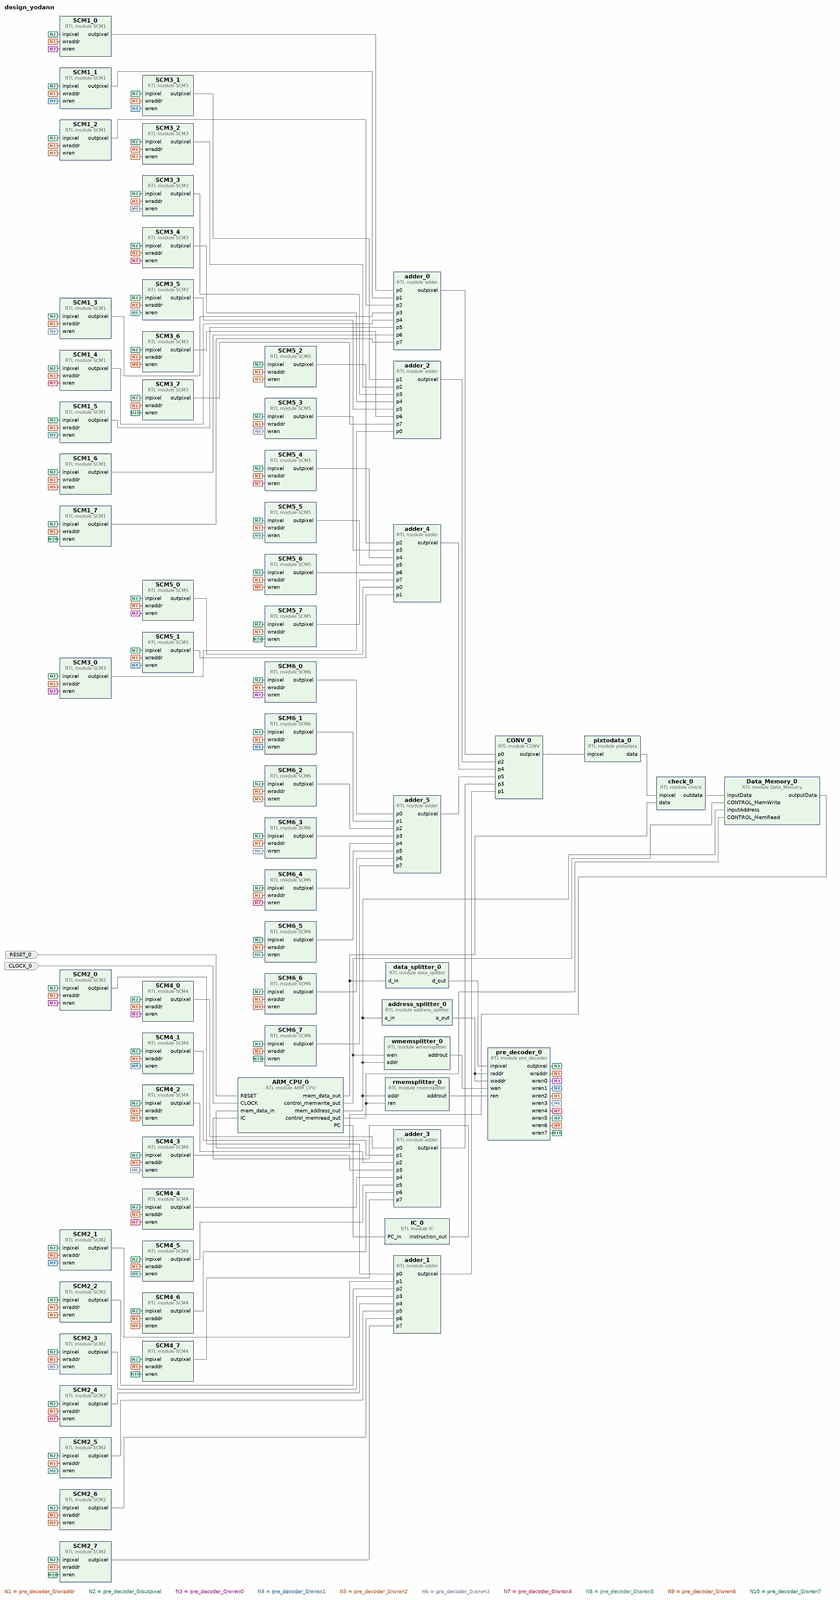
[diagram p0: block diagram of the top level, whole]
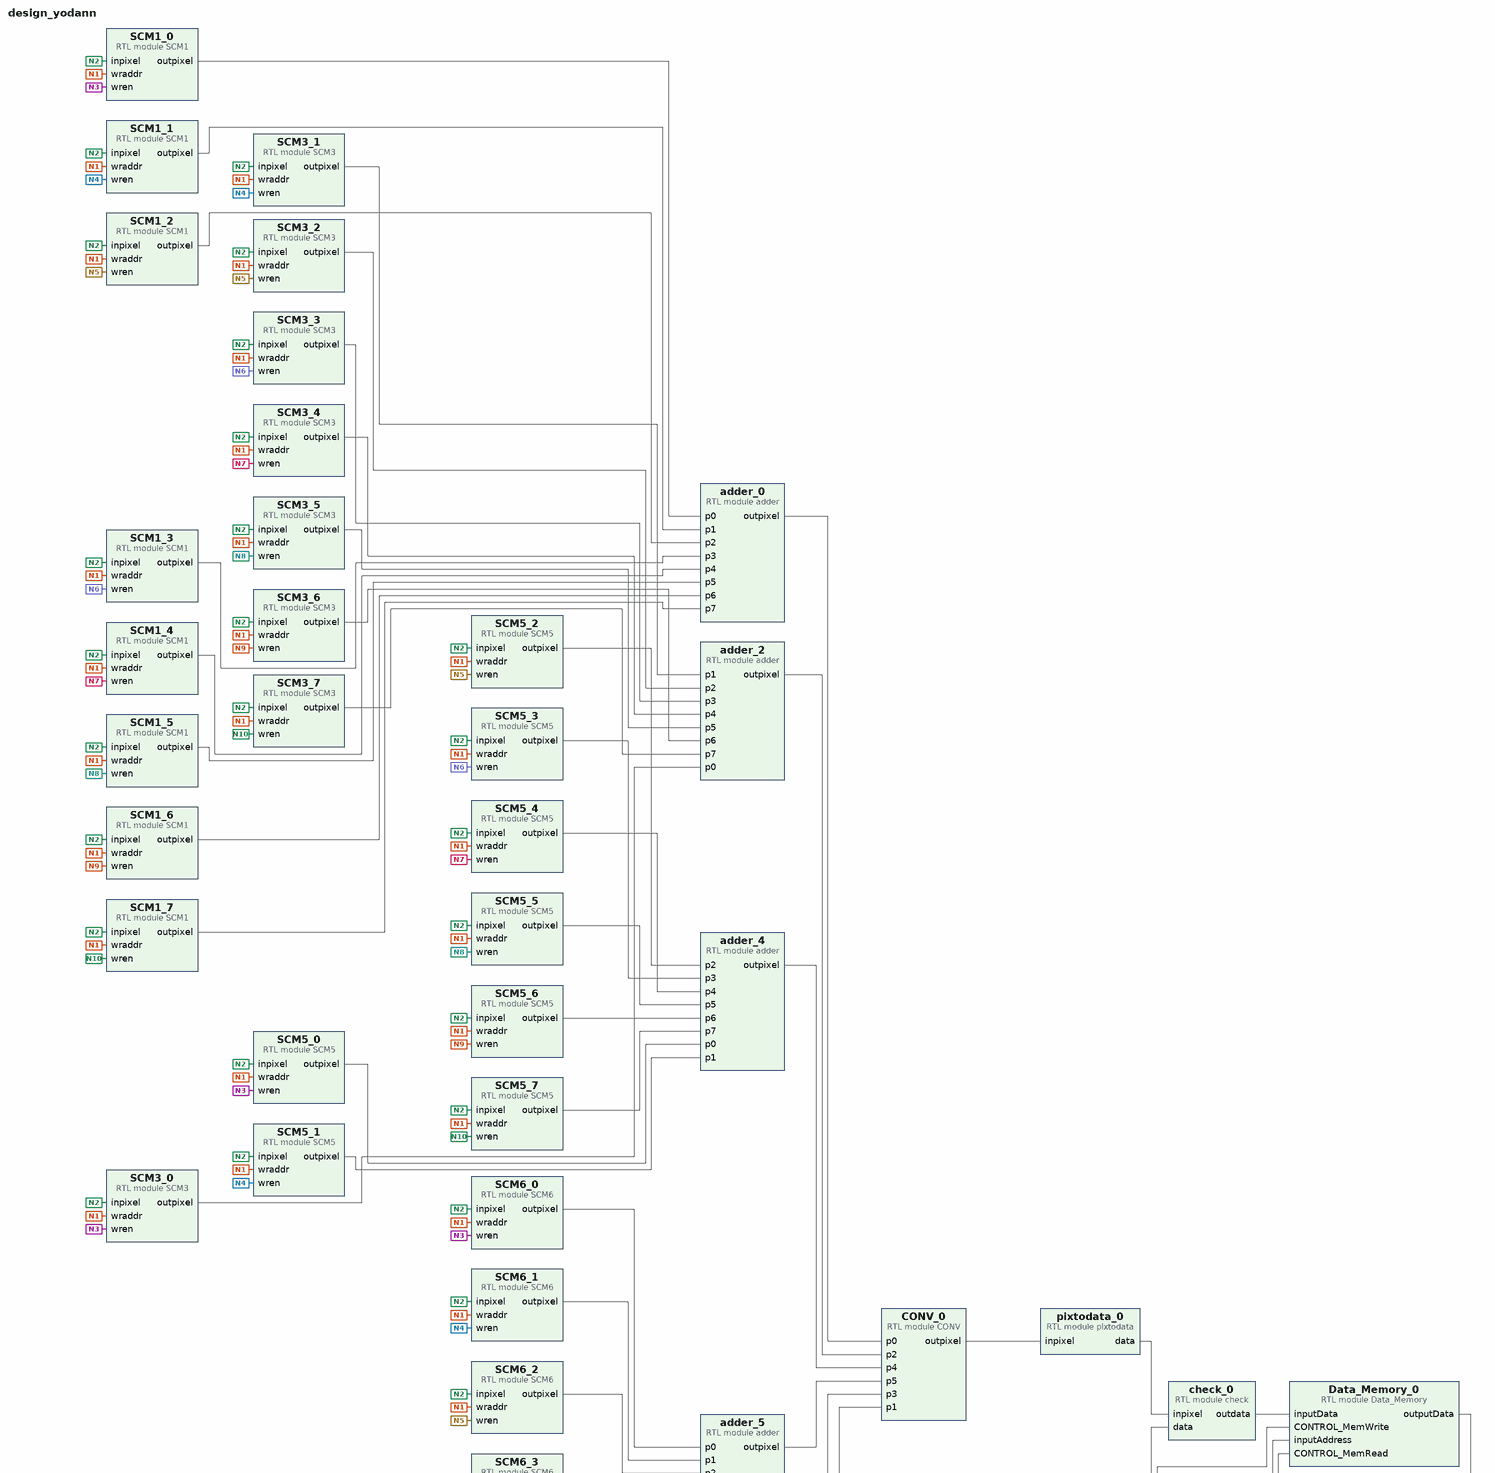
[diagram p1: block diagram of the top level, upper part]
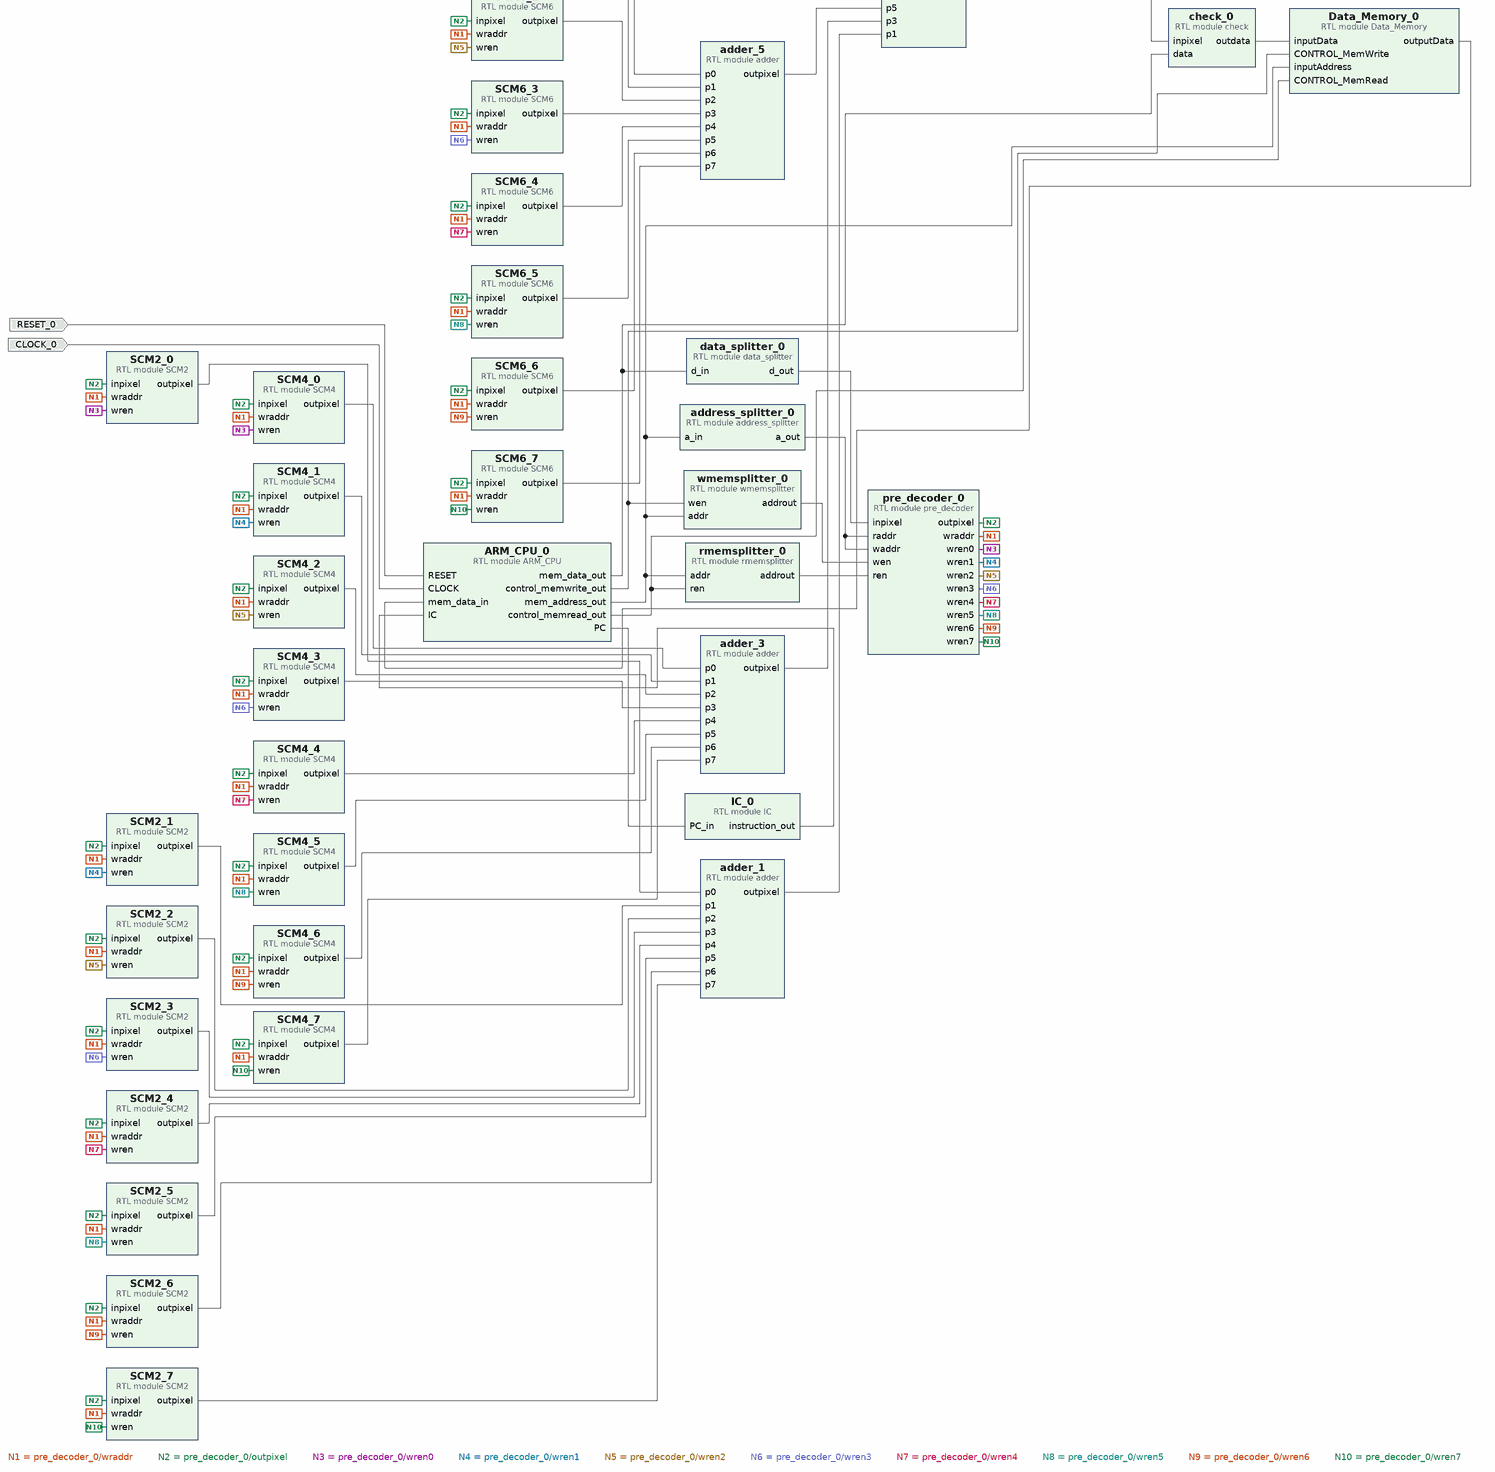
[diagram p2: block diagram of the top level, lower part]
# Vivado block design design_yodann, xc7a100tcsg324-1, Vivado 2018.3
create_bd_design design_yodann

create_bd_port -dir I -type rst RESET_0
create_bd_port -dir I -type clk CLOCK_0

create_bd_cell -type module -reference ARM_CPU ARM_CPU_0
create_bd_cell -type module -reference IC IC_0
create_bd_cell -type module -reference address_splitter address_splitter_0
create_bd_cell -type module -reference data_splitter data_splitter_0
create_bd_cell -type module -reference rmemsplitter rmemsplitter_0
create_bd_cell -type module -reference wmemsplitter wmemsplitter_0
create_bd_cell -type module -reference pre_decoder pre_decoder_0
create_bd_cell -type module -reference pixtodata pixtodata_0
create_bd_cell -type module -reference SCM1 SCM1_0
create_bd_cell -type module -reference SCM1 SCM1_1
create_bd_cell -type module -reference SCM1 SCM1_2
create_bd_cell -type module -reference SCM1 SCM1_3
create_bd_cell -type module -reference SCM1 SCM1_4
create_bd_cell -type module -reference SCM1 SCM1_5
create_bd_cell -type module -reference SCM1 SCM1_6
create_bd_cell -type module -reference SCM1 SCM1_7
create_bd_cell -type module -reference SCM2 SCM2_0
create_bd_cell -type module -reference SCM2 SCM2_1
create_bd_cell -type module -reference SCM2 SCM2_2
create_bd_cell -type module -reference SCM2 SCM2_3
create_bd_cell -type module -reference SCM2 SCM2_4
create_bd_cell -type module -reference SCM2 SCM2_5
create_bd_cell -type module -reference SCM2 SCM2_6
create_bd_cell -type module -reference SCM2 SCM2_7
create_bd_cell -type module -reference SCM3 SCM3_0
create_bd_cell -type module -reference SCM3 SCM3_1
create_bd_cell -type module -reference SCM3 SCM3_2
create_bd_cell -type module -reference SCM3 SCM3_3
create_bd_cell -type module -reference SCM3 SCM3_4
create_bd_cell -type module -reference SCM3 SCM3_5
create_bd_cell -type module -reference SCM3 SCM3_6
create_bd_cell -type module -reference SCM3 SCM3_7
create_bd_cell -type module -reference SCM4 SCM4_0
create_bd_cell -type module -reference SCM4 SCM4_1
create_bd_cell -type module -reference SCM4 SCM4_2
create_bd_cell -type module -reference SCM4 SCM4_3
create_bd_cell -type module -reference SCM4 SCM4_4
create_bd_cell -type module -reference SCM4 SCM4_5
create_bd_cell -type module -reference SCM4 SCM4_6
create_bd_cell -type module -reference SCM4 SCM4_7
create_bd_cell -type module -reference SCM5 SCM5_0
create_bd_cell -type module -reference SCM5 SCM5_1
create_bd_cell -type module -reference SCM5 SCM5_2
create_bd_cell -type module -reference SCM5 SCM5_3
create_bd_cell -type module -reference SCM5 SCM5_4
create_bd_cell -type module -reference SCM5 SCM5_5
create_bd_cell -type module -reference SCM5 SCM5_6
create_bd_cell -type module -reference SCM5 SCM5_7
create_bd_cell -type module -reference SCM6 SCM6_0
create_bd_cell -type module -reference SCM6 SCM6_1
create_bd_cell -type module -reference SCM6 SCM6_2
create_bd_cell -type module -reference SCM6 SCM6_3
create_bd_cell -type module -reference SCM6 SCM6_4
create_bd_cell -type module -reference SCM6 SCM6_5
create_bd_cell -type module -reference SCM6 SCM6_6
create_bd_cell -type module -reference SCM6 SCM6_7
create_bd_cell -type module -reference Data_Memory Data_Memory_0
create_bd_cell -type module -reference adder adder_0
create_bd_cell -type module -reference adder adder_1
create_bd_cell -type module -reference adder adder_2
create_bd_cell -type module -reference adder adder_3
create_bd_cell -type module -reference adder adder_4
create_bd_cell -type module -reference adder adder_5
create_bd_cell -type module -reference CONV CONV_0
create_bd_cell -type module -reference check check_0

# ---- connections ----

connect_bd_net [get_bd_pins ARM_CPU_0/PC] [get_bd_pins IC_0/PC_in]
connect_bd_net [get_bd_pins IC_0/instruction_out] [get_bd_pins ARM_CPU_0/IC]
connect_bd_net -net RESET_0_1 [get_bd_ports RESET_0] [get_bd_pins ARM_CPU_0/RESET]
connect_bd_net -net CLOCK_0_1 [get_bd_ports CLOCK_0] [get_bd_pins ARM_CPU_0/CLOCK]
connect_bd_net [get_bd_pins ARM_CPU_0/control_memwrite_out] [get_bd_pins wmemsplitter_0/wen] [get_bd_pins Data_Memory_0/CONTROL_MemWrite]
connect_bd_net [get_bd_pins ARM_CPU_0/control_memread_out] [get_bd_pins rmemsplitter_0/ren] [get_bd_pins Data_Memory_0/CONTROL_MemRead]
connect_bd_net [get_bd_pins address_splitter_0/a_out] [get_bd_pins pre_decoder_0/waddr] [get_bd_pins pre_decoder_0/raddr]
connect_bd_net [get_bd_pins data_splitter_0/d_out] [get_bd_pins pre_decoder_0/inpixel]
connect_bd_net [get_bd_pins wmemsplitter_0/addrout] [get_bd_pins pre_decoder_0/wen]
connect_bd_net [get_bd_pins rmemsplitter_0/addrout] [get_bd_pins pre_decoder_0/ren]
connect_bd_net [get_bd_pins pre_decoder_0/wraddr] \
  [get_bd_pins SCM1_0/wraddr] [get_bd_pins SCM1_1/wraddr] [get_bd_pins SCM1_2/wraddr] [get_bd_pins SCM1_3/wraddr] \
  [get_bd_pins SCM1_4/wraddr] [get_bd_pins SCM1_5/wraddr] [get_bd_pins SCM1_6/wraddr] [get_bd_pins SCM1_7/wraddr] \
  [get_bd_pins SCM2_0/wraddr] [get_bd_pins SCM2_1/wraddr] [get_bd_pins SCM2_2/wraddr] [get_bd_pins SCM2_3/wraddr] \
  [get_bd_pins SCM2_4/wraddr] [get_bd_pins SCM2_5/wraddr] [get_bd_pins SCM2_6/wraddr] [get_bd_pins SCM2_7/wraddr] \
  [get_bd_pins SCM3_0/wraddr] [get_bd_pins SCM3_1/wraddr] [get_bd_pins SCM3_2/wraddr] [get_bd_pins SCM3_3/wraddr] \
  [get_bd_pins SCM3_4/wraddr] [get_bd_pins SCM3_5/wraddr] [get_bd_pins SCM3_6/wraddr] [get_bd_pins SCM3_7/wraddr] \
  [get_bd_pins SCM4_0/wraddr] [get_bd_pins SCM4_1/wraddr] [get_bd_pins SCM4_2/wraddr] [get_bd_pins SCM4_3/wraddr] \
  [get_bd_pins SCM4_4/wraddr] [get_bd_pins SCM4_5/wraddr] [get_bd_pins SCM4_6/wraddr] [get_bd_pins SCM4_7/wraddr] \
  [get_bd_pins SCM5_0/wraddr] [get_bd_pins SCM5_1/wraddr] [get_bd_pins SCM5_2/wraddr] [get_bd_pins SCM5_3/wraddr] \
  [get_bd_pins SCM5_4/wraddr] [get_bd_pins SCM5_5/wraddr] [get_bd_pins SCM5_6/wraddr] [get_bd_pins SCM5_7/wraddr] \
  [get_bd_pins SCM6_0/wraddr] [get_bd_pins SCM6_1/wraddr] [get_bd_pins SCM6_2/wraddr] [get_bd_pins SCM6_3/wraddr] \
  [get_bd_pins SCM6_4/wraddr] [get_bd_pins SCM6_5/wraddr] [get_bd_pins SCM6_6/wraddr] [get_bd_pins SCM6_7/wraddr]
connect_bd_net [get_bd_pins pre_decoder_0/outpixel] \
  [get_bd_pins SCM1_0/inpixel] [get_bd_pins SCM1_1/inpixel] [get_bd_pins SCM1_2/inpixel] [get_bd_pins SCM1_3/inpixel] \
  [get_bd_pins SCM1_4/inpixel] [get_bd_pins SCM1_5/inpixel] [get_bd_pins SCM1_6/inpixel] [get_bd_pins SCM1_7/inpixel] \
  [get_bd_pins SCM2_0/inpixel] [get_bd_pins SCM2_1/inpixel] [get_bd_pins SCM2_2/inpixel] [get_bd_pins SCM2_3/inpixel] \
  [get_bd_pins SCM2_4/inpixel] [get_bd_pins SCM2_5/inpixel] [get_bd_pins SCM2_6/inpixel] [get_bd_pins SCM2_7/inpixel] \
  [get_bd_pins SCM3_0/inpixel] [get_bd_pins SCM3_1/inpixel] [get_bd_pins SCM3_2/inpixel] [get_bd_pins SCM3_3/inpixel] \
  [get_bd_pins SCM3_4/inpixel] [get_bd_pins SCM3_5/inpixel] [get_bd_pins SCM3_6/inpixel] [get_bd_pins SCM3_7/inpixel] \
  [get_bd_pins SCM4_0/inpixel] [get_bd_pins SCM4_1/inpixel] [get_bd_pins SCM4_2/inpixel] [get_bd_pins SCM4_3/inpixel] \
  [get_bd_pins SCM4_4/inpixel] [get_bd_pins SCM4_5/inpixel] [get_bd_pins SCM4_6/inpixel] [get_bd_pins SCM4_7/inpixel] \
  [get_bd_pins SCM5_0/inpixel] [get_bd_pins SCM5_1/inpixel] [get_bd_pins SCM5_2/inpixel] [get_bd_pins SCM5_3/inpixel] \
  [get_bd_pins SCM5_4/inpixel] [get_bd_pins SCM5_5/inpixel] [get_bd_pins SCM5_6/inpixel] [get_bd_pins SCM5_7/inpixel] \
  [get_bd_pins SCM6_0/inpixel] [get_bd_pins SCM6_1/inpixel] [get_bd_pins SCM6_2/inpixel] [get_bd_pins SCM6_3/inpixel] \
  [get_bd_pins SCM6_4/inpixel] [get_bd_pins SCM6_5/inpixel] [get_bd_pins SCM6_6/inpixel] [get_bd_pins SCM6_7/inpixel]
connect_bd_net [get_bd_pins pre_decoder_0/wren0] \
  [get_bd_pins SCM1_0/wren] [get_bd_pins SCM2_0/wren] [get_bd_pins SCM3_0/wren] [get_bd_pins SCM4_0/wren] \
  [get_bd_pins SCM5_0/wren] [get_bd_pins SCM6_0/wren]
connect_bd_net [get_bd_pins pre_decoder_0/wren1] \
  [get_bd_pins SCM1_1/wren] [get_bd_pins SCM2_1/wren] [get_bd_pins SCM3_1/wren] [get_bd_pins SCM4_1/wren] \
  [get_bd_pins SCM5_1/wren] [get_bd_pins SCM6_1/wren]
connect_bd_net [get_bd_pins pre_decoder_0/wren2] \
  [get_bd_pins SCM1_2/wren] [get_bd_pins SCM2_2/wren] [get_bd_pins SCM3_2/wren] [get_bd_pins SCM4_2/wren] \
  [get_bd_pins SCM5_2/wren] [get_bd_pins SCM6_2/wren]
connect_bd_net [get_bd_pins pre_decoder_0/wren3] \
  [get_bd_pins SCM1_3/wren] [get_bd_pins SCM2_3/wren] [get_bd_pins SCM3_3/wren] [get_bd_pins SCM4_3/wren] \
  [get_bd_pins SCM5_3/wren] [get_bd_pins SCM6_3/wren]
connect_bd_net [get_bd_pins pre_decoder_0/wren4] \
  [get_bd_pins SCM1_4/wren] [get_bd_pins SCM2_4/wren] [get_bd_pins SCM3_4/wren] [get_bd_pins SCM4_4/wren] \
  [get_bd_pins SCM5_4/wren] [get_bd_pins SCM6_4/wren]
connect_bd_net [get_bd_pins pre_decoder_0/wren5] \
  [get_bd_pins SCM1_5/wren] [get_bd_pins SCM2_5/wren] [get_bd_pins SCM3_5/wren] [get_bd_pins SCM4_5/wren] \
  [get_bd_pins SCM5_5/wren] [get_bd_pins SCM6_5/wren]
connect_bd_net [get_bd_pins pre_decoder_0/wren6] \
  [get_bd_pins SCM1_6/wren] [get_bd_pins SCM2_6/wren] [get_bd_pins SCM3_6/wren] [get_bd_pins SCM4_6/wren] \
  [get_bd_pins SCM5_6/wren] [get_bd_pins SCM6_6/wren]
connect_bd_net [get_bd_pins pre_decoder_0/wren7] \
  [get_bd_pins SCM1_7/wren] [get_bd_pins SCM2_7/wren] [get_bd_pins SCM3_7/wren] [get_bd_pins SCM4_7/wren] \
  [get_bd_pins SCM5_7/wren] [get_bd_pins SCM6_7/wren]
connect_bd_net [get_bd_pins SCM1_0/outpixel] [get_bd_pins adder_0/p0]
connect_bd_net [get_bd_pins SCM1_1/outpixel] [get_bd_pins adder_0/p1]
connect_bd_net [get_bd_pins SCM1_2/outpixel] [get_bd_pins adder_0/p2]
connect_bd_net [get_bd_pins SCM1_3/outpixel] [get_bd_pins adder_0/p3]
connect_bd_net [get_bd_pins SCM1_4/outpixel] [get_bd_pins adder_0/p4]
connect_bd_net [get_bd_pins SCM1_5/outpixel] [get_bd_pins adder_0/p5]
connect_bd_net [get_bd_pins SCM1_6/outpixel] [get_bd_pins adder_0/p6]
connect_bd_net [get_bd_pins SCM1_7/outpixel] [get_bd_pins adder_0/p7]
connect_bd_net [get_bd_pins SCM2_0/outpixel] [get_bd_pins adder_1/p0]
connect_bd_net [get_bd_pins SCM2_1/outpixel] [get_bd_pins adder_1/p1]
connect_bd_net [get_bd_pins SCM2_2/outpixel] [get_bd_pins adder_1/p2]
connect_bd_net [get_bd_pins SCM2_3/outpixel] [get_bd_pins adder_1/p3]
connect_bd_net [get_bd_pins SCM2_4/outpixel] [get_bd_pins adder_1/p4]
connect_bd_net [get_bd_pins SCM2_5/outpixel] [get_bd_pins adder_1/p5]
connect_bd_net [get_bd_pins SCM2_6/outpixel] [get_bd_pins adder_1/p6]
connect_bd_net [get_bd_pins SCM2_7/outpixel] [get_bd_pins adder_1/p7]
connect_bd_net [get_bd_pins SCM3_0/outpixel] [get_bd_pins adder_2/p0]
connect_bd_net [get_bd_pins SCM3_1/outpixel] [get_bd_pins adder_2/p1]
connect_bd_net [get_bd_pins SCM3_2/outpixel] [get_bd_pins adder_2/p2]
connect_bd_net [get_bd_pins SCM3_3/outpixel] [get_bd_pins adder_2/p3]
connect_bd_net [get_bd_pins SCM3_4/outpixel] [get_bd_pins adder_2/p4]
connect_bd_net [get_bd_pins SCM3_5/outpixel] [get_bd_pins adder_2/p5]
connect_bd_net [get_bd_pins SCM3_6/outpixel] [get_bd_pins adder_2/p6]
connect_bd_net [get_bd_pins SCM3_7/outpixel] [get_bd_pins adder_2/p7]
connect_bd_net [get_bd_pins SCM4_0/outpixel] [get_bd_pins adder_3/p0]
connect_bd_net [get_bd_pins SCM4_1/outpixel] [get_bd_pins adder_3/p1]
connect_bd_net [get_bd_pins SCM4_2/outpixel] [get_bd_pins adder_3/p2]
connect_bd_net [get_bd_pins SCM4_3/outpixel] [get_bd_pins adder_3/p3]
connect_bd_net [get_bd_pins SCM4_4/outpixel] [get_bd_pins adder_3/p4]
connect_bd_net [get_bd_pins SCM4_5/outpixel] [get_bd_pins adder_3/p5]
connect_bd_net [get_bd_pins SCM4_6/outpixel] [get_bd_pins adder_3/p6]
connect_bd_net [get_bd_pins SCM4_7/outpixel] [get_bd_pins adder_3/p7]
connect_bd_net [get_bd_pins SCM5_0/outpixel] [get_bd_pins adder_4/p0]
connect_bd_net [get_bd_pins SCM5_1/outpixel] [get_bd_pins adder_4/p1]
connect_bd_net [get_bd_pins SCM5_2/outpixel] [get_bd_pins adder_4/p2]
connect_bd_net [get_bd_pins SCM5_3/outpixel] [get_bd_pins adder_4/p3]
connect_bd_net [get_bd_pins SCM5_4/outpixel] [get_bd_pins adder_4/p4]
connect_bd_net [get_bd_pins SCM5_5/outpixel] [get_bd_pins adder_4/p5]
connect_bd_net [get_bd_pins SCM5_6/outpixel] [get_bd_pins adder_4/p6]
connect_bd_net [get_bd_pins SCM5_7/outpixel] [get_bd_pins adder_4/p7]
connect_bd_net [get_bd_pins SCM6_0/outpixel] [get_bd_pins adder_5/p0]
connect_bd_net [get_bd_pins SCM6_1/outpixel] [get_bd_pins adder_5/p1]
connect_bd_net [get_bd_pins SCM6_2/outpixel] [get_bd_pins adder_5/p2]
connect_bd_net [get_bd_pins SCM6_3/outpixel] [get_bd_pins adder_5/p3]
connect_bd_net [get_bd_pins SCM6_4/outpixel] [get_bd_pins adder_5/p4]
connect_bd_net [get_bd_pins SCM6_5/outpixel] [get_bd_pins adder_5/p5]
connect_bd_net [get_bd_pins SCM6_6/outpixel] [get_bd_pins adder_5/p6]
connect_bd_net [get_bd_pins SCM6_7/outpixel] [get_bd_pins adder_5/p7]
connect_bd_net [get_bd_pins adder_0/outpixel] [get_bd_pins CONV_0/p0]
connect_bd_net [get_bd_pins adder_1/outpixel] [get_bd_pins CONV_0/p1]
connect_bd_net [get_bd_pins adder_2/outpixel] [get_bd_pins CONV_0/p2]
connect_bd_net [get_bd_pins adder_3/outpixel] [get_bd_pins CONV_0/p3]
connect_bd_net [get_bd_pins adder_4/outpixel] [get_bd_pins CONV_0/p4]
connect_bd_net [get_bd_pins adder_5/outpixel] [get_bd_pins CONV_0/p5]
connect_bd_net [get_bd_pins CONV_0/outpixel] [get_bd_pins pixtodata_0/inpixel]
connect_bd_net [get_bd_pins Data_Memory_0/outputData] [get_bd_pins ARM_CPU_0/mem_data_in]
connect_bd_net [get_bd_pins ARM_CPU_0/mem_address_out] \
  [get_bd_pins address_splitter_0/a_in] [get_bd_pins wmemsplitter_0/addr] [get_bd_pins rmemsplitter_0/addr] \
  [get_bd_pins Data_Memory_0/inputAddress]
connect_bd_net [get_bd_pins ARM_CPU_0/mem_data_out] [get_bd_pins data_splitter_0/d_in] [get_bd_pins check_0/data]
connect_bd_net [get_bd_pins pixtodata_0/data] [get_bd_pins check_0/inpixel]
connect_bd_net -net check_0_out [get_bd_pins check_0/outdata] [get_bd_pins Data_Memory_0/inputData]

validate_bd_design
save_bd_design
